# Altium schematic sheet x-IMU3-SA-Breakout.SchDoc
size A4; SheetNumber: 1; SheetTotal: 1
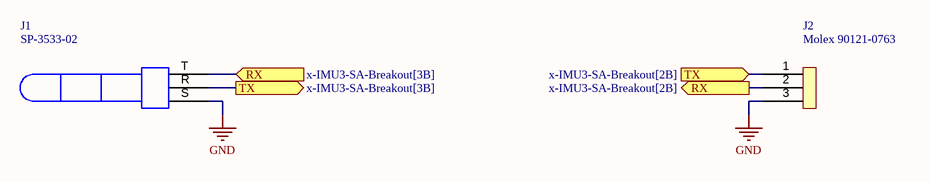
[diagram p0: x-IMU3-SA-Breakout.SchDoc]

## Parts
J1  SP-3533-02  [SP-3533-02]
J2  Molex 90121-0763  [Molex 90121-0763]

## Ports
RX (in, see x-IMU3-SA-Breakout[3B]), RX (out, see x-IMU3-SA-Breakout[2B]), TX (in, see x-IMU3-SA-Breakout[2B]), TX (out, see x-IMU3-SA-Breakout[3B])

## Nets
GND: J1.S J2.3
RX: J1.T J2.2 ; port RX
TX: J1.R J2.1 ; port TX

## Notes on the sheet
- TITLE
- SIZE
- A4
- VARIANT
- PROJECT
- SHEET
- VERSION
- OF
- AUTHOR
- DATE